# EAGLE design Piano Captouch (EAGLE 9.6.2)
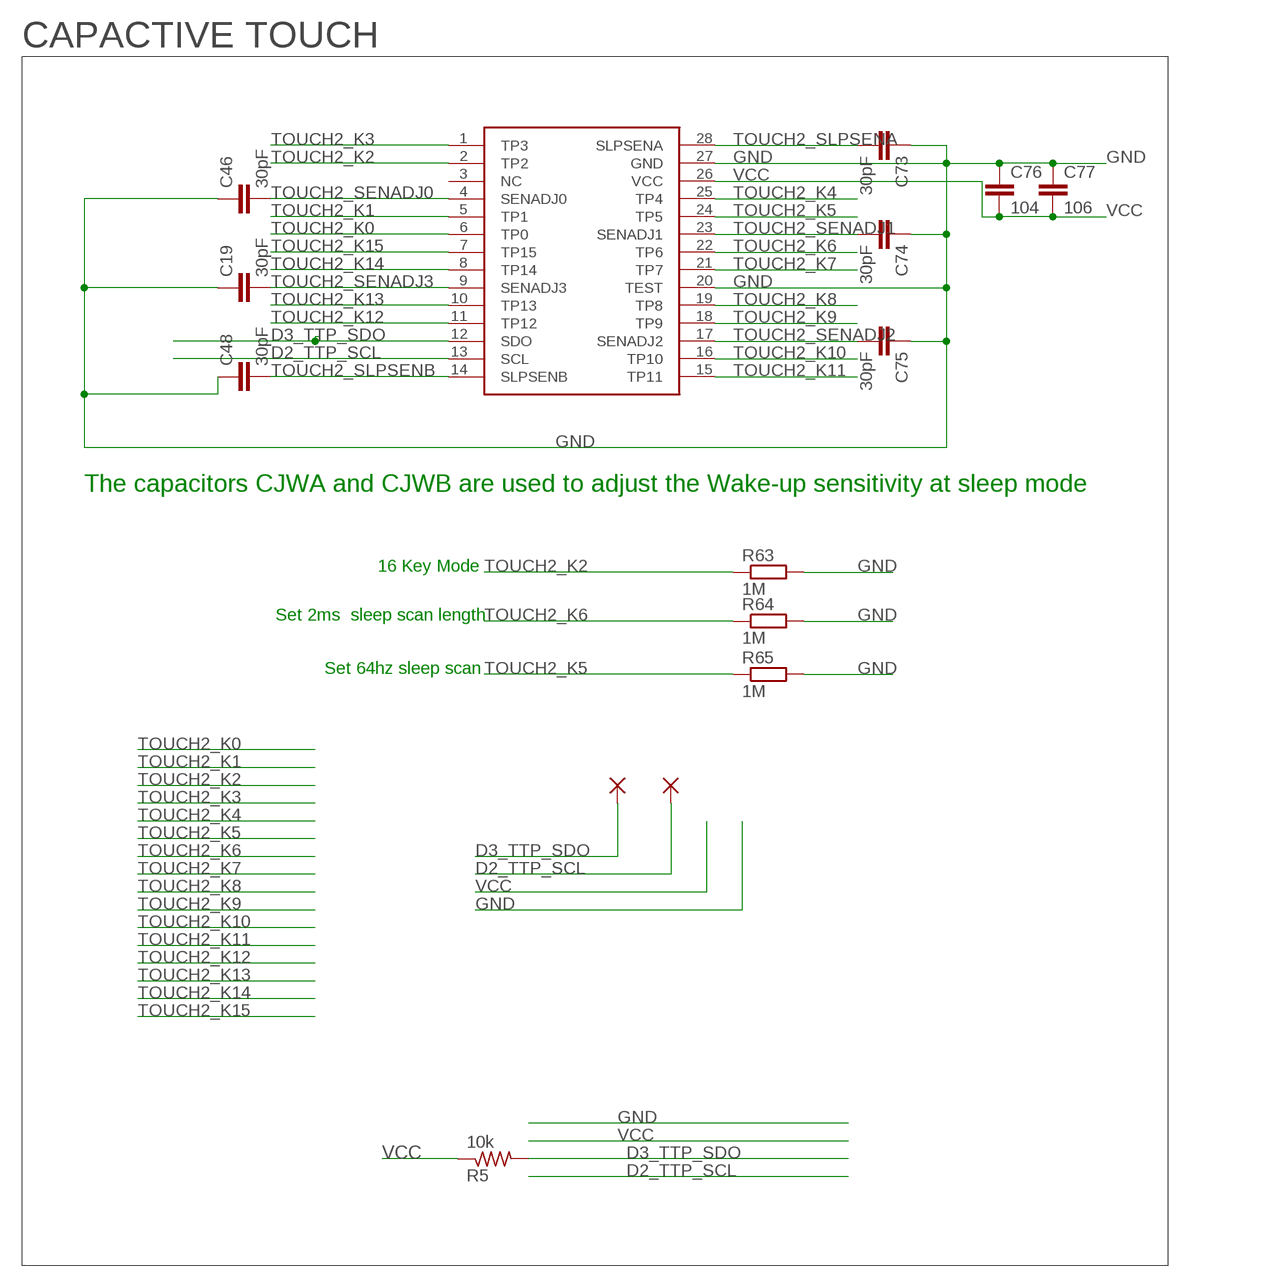
[diagram p0: schematic, sheet 1, part 1 of 2]
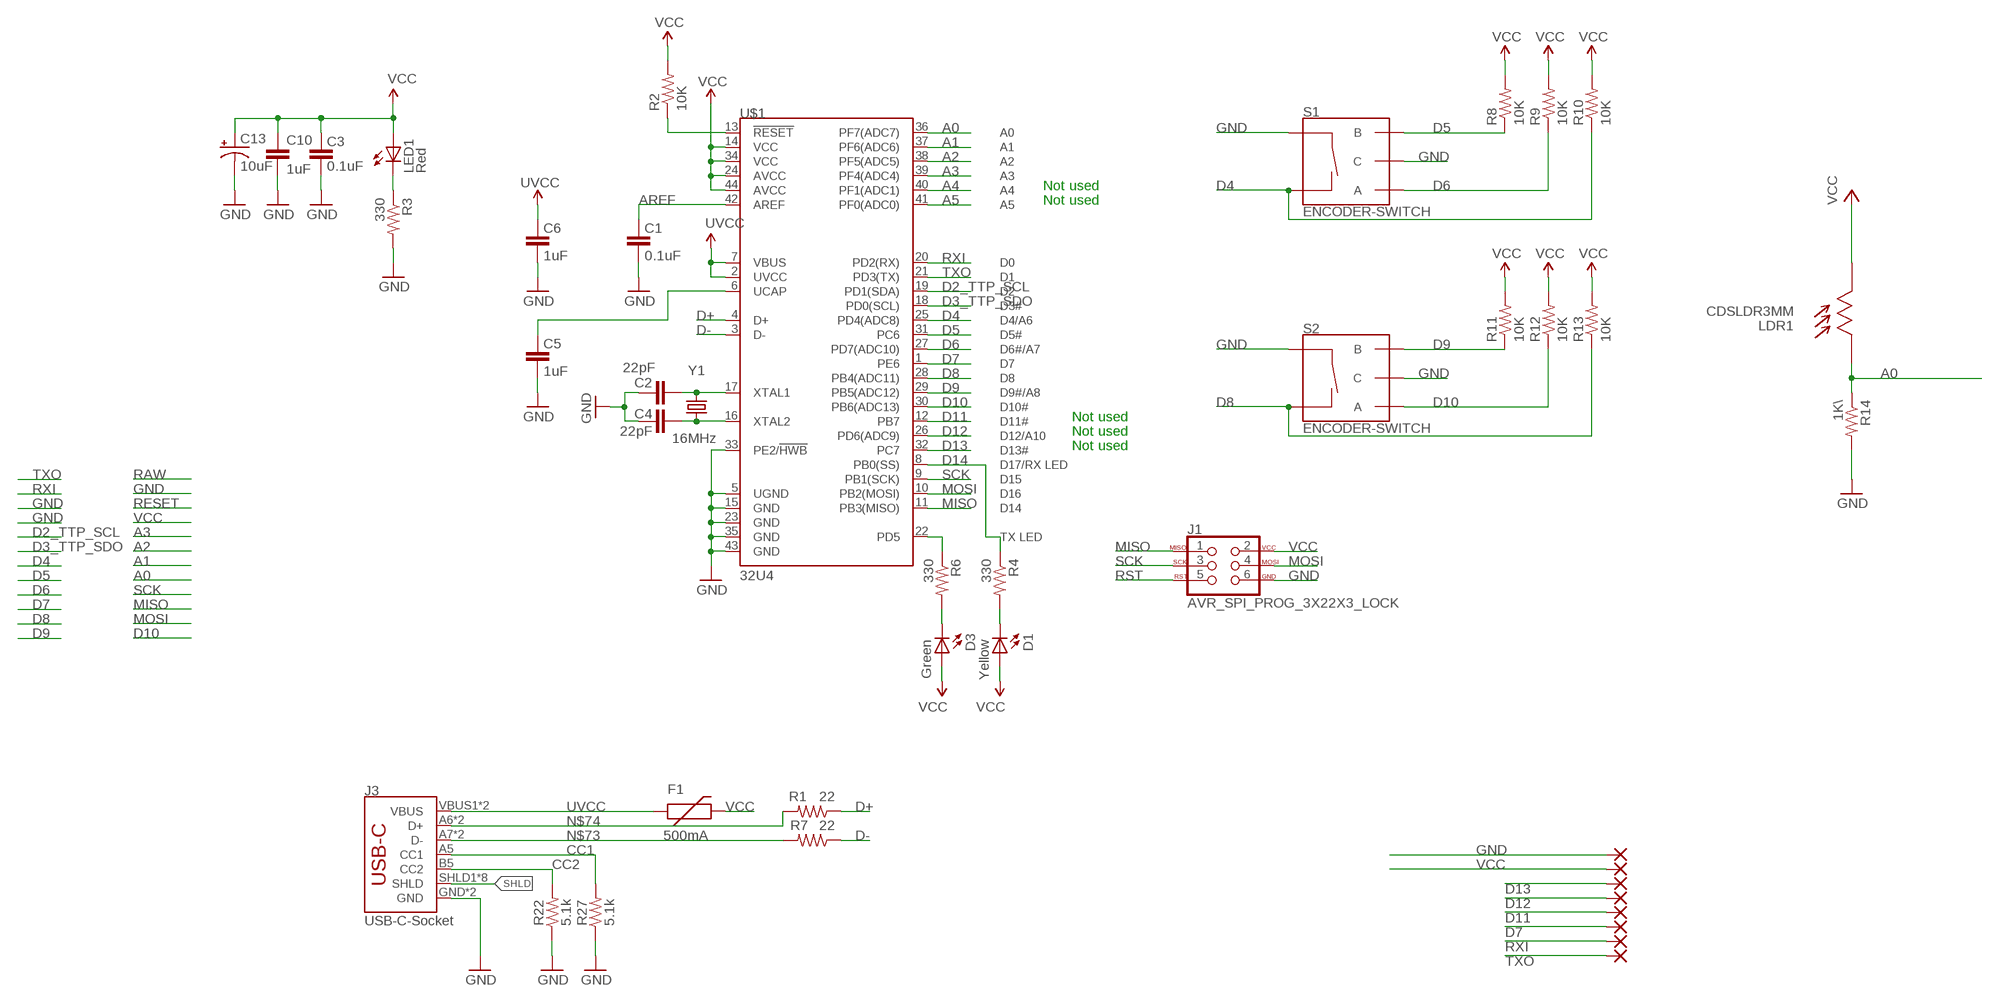
[diagram p1: schematic, sheet 1, part 2 of 2]

## Parts
C1  0.1uF  CAP0603-CAP  [0603-CAP]
C2  22pF  CAP0603-CAP  [0603-CAP]
C3  0.1uF  CAP0603-CAP  [0603-CAP]
C4  22pF  CAP0603-CAP  [0603-CAP]
C5  1uF  CAP0805  [0805]
C6  1uF  CAP0603-CAP  [0603-CAP]
C10  1uF  CAP0805  [0805]
C13  10uF  CAP_POL1206  [EIA3216]
C19  30pF  C-EUC0603K  [C0603K]
C46  30pF  C-EUC0603K  [C0603K]
C48  30pF  C-EUC0603K  [C0603K]
C73  30pF  C-EUC0603K  [C0603K]
C74  30pF  C-EUC0603K  [C0603K]
C75  30pF  C-EUC0603K  [C0603K]
C76  104  C-EUC0603K  [C0603K]
C77  106  C-EUC1206  [C1206]
D1  Yellow  LED0603  [LED-0603]
D3  Green  LED0603  [LED-0603]
F1  500mA  PTCSMD  [PTC-1206]
IC1  TTP229  [TTP229-SSOP28]
J1  AVR_SPI_PROG_3X22X3_LOCK  [2X3_LOCK]
J3  USB-C-Socket  USB_C16PIN  [USB-C-16P]
LDR1  CDSLDR3MM  [LDR3MM]
LED1  Red  LED0603  [LED-0603]
PAD1  2,15/1,0  [2,15/1,0]
PAD2  2,15/1,0  [2,15/1,0]
PAD3  2,15/1,0  [2,15/1,0]
PAD4  2,15/1,0  [2,15/1,0]
PAD5  2,15/1,0  [2,15/1,0]
PAD6  2,15/1,0  [2,15/1,0]
PAD7  2,15/1,0  [2,15/1,0]
PAD8  2,15/1,0  [2,15/1,0]
PAD9  2,15/1,0  [2,15/1,0]
PAD10  2,15/1,0  [2,15/1,0]
R1  22  RESISTOR0603-RES  [0603-RES]
R2  10K  RESISTOR0603-RES  [0603-RES]
R3  330  RESISTOR0603-RES  [0603-RES]
R4  330  RESISTOR0603-RES  [0603-RES]
R5  10k  R-US_R0603  [R0603]
R6  330  RESISTOR0603-RES  [0603-RES]
R7  22  RESISTOR0603-RES  [0603-RES]
R8  10K  RESISTOR0603-RES  [0603-RES]
R9  10K  RESISTOR0603-RES  [0603-RES]
R10  10K  RESISTOR0603-RES  [0603-RES]
R11  10K  RESISTOR0603-RES  [0603-RES]
R12  10K  RESISTOR0603-RES  [0603-RES]
R13  10K  RESISTOR0603-RES  [0603-RES]
R14  1K\  RESISTOR0603-RES  [0603-RES]
R22  5.1k  5.1KOHM5.1KOHM-0603-1/10W-1%  [0603@1]
R27  5.1k  5.1KOHM5.1KOHM-0603-1/10W-1%  [0603@1]
R63  1M  R-EU_R0603  [R0603]
R64  1M  R-EU_R0603  [R0603]
R65  1M  R-EU_R0603  [R0603]
S1  ENCODER-SWITCH  [ROTARY_ENC_PLAIN]
S2  ENCODER-SWITCH  [ROTARY_ENC_PLAIN]
U$1  32U4  ATMEGA32U4TQFP-44  [TQFP44]
Y1  16MHz  CRYSTALHC49UV  [HC49U-V]

## Nets
A0: LDR1.P$1 R14.1 U$1.36(PF7(ADC7))
A1: U$1.37(PF6(ADC6))
A2: U$1.38(PF5(ADC5))
A3: U$1.39(PF4(ADC4))
A4: U$1.40(PF1(ADC1))
A5: U$1.41(PF0(ADC0))
AREF: C1.2 U$1.42(AREF)
CC1: J3.A5(CC1) R27.2
CC2: J3.B5(CC2) R22.2
D2_TTP_SCL: IC1.13(SCL) PAD10.1(P) U$1.19(PD1(SDA))
D3_TTP_SDO: IC1.12(SDO) PAD9.1(P) R5.2 U$1.18(PD0(SCL))
D4: R10.1 S1.SW- U$1.25(PD4(ADC8))
D5: R8.1 S1.B U$1.31(PC6)
D6: R9.1 S1.A U$1.27(PD7(ADC10))
D7: PAD4.1(P) U$1.1(PE6)
D8: R13.1 S2.SW- U$1.28(PB4(ADC11))
D9: R11.1 S2.B U$1.29(PB5(ADC12))
D10: R12.1 S2.A U$1.30(PB6(ADC13))
D11: PAD3.1(P) U$1.12(PB7)
D12: PAD2.1(P) U$1.26(PD6(ADC9))
D13: PAD1.1(P) U$1.32(PC7)
D14: R4.1 U$1.8(PB0(SS))
D+: R1.1 U$1.4(D+)
D-: R7.1 U$1.3(D-)
GND: C1.1 C2.2 C3.1 C4.2 C5.1 C6.1 C10.2 C13.C(-) C19.1 C46.1 C48.1 C73.1 C74.1 C75.1 C76.1 C77.1 IC1.20(TEST) IC1.27(GND) J1.6 J3.GND J3.GND2(GND) PAD8.1(P) R3.2 R14.2 R22.1 R27.1 R63.2 R64.2 R65.2 S1.C S1.SW+ S2.C S2.SW+ U$1.5(UGND) U$1.15(GND) U$1.23(GND) U$1.33(PE2/!HWB) U$1.35(GND) U$1.43(GND)
MISO: J1.1 U$1.11(PB3(MISO))
MOSI: J1.4 U$1.10(PB2(MOSI))
N$6: LED1.C R3.1
N$33: C4.1 U$1.16(XTAL2) Y1.1
N$57: C2.1 U$1.17(XTAL1) Y1.2
N$71: C5.2 U$1.6(UCAP)
N$73: J3.A7(D-) J3.B7(D-) R7.2
N$74: J3.A6(D+) J3.B6(D+) R1.2
N$75: D1.C R4.2
N$76: D3.C R6.2
RESET: R2.1 U$1.13(!RESET)
RST: J1.5
RXI: PAD5.1(P) U$1.20(PD2(RX))
SCK: J1.3 U$1.9(PB1(SCK))
SHLD: J3.SHLD1(SHLD) J3.SHLD2(SHLD) J3.SHLD3(SHLD) J3.SHLD4(SHLD) J3.SHLD5(SHLD) J3.SHLD6(SHLD) J3.SHLD7(SHLD) J3.SHLD8(SHLD)
TOUCH2_K0: IC1.6(TP0)
TOUCH2_K1: IC1.5(TP1)
TOUCH2_K2: IC1.2(TP2) R63.1
TOUCH2_K3: IC1.1(TP3)
TOUCH2_K4: IC1.25(TP4)
TOUCH2_K5: IC1.24(TP5) R65.1
TOUCH2_K6: IC1.22(TP6) R64.1
TOUCH2_K7: IC1.21(TP7)
TOUCH2_K8: IC1.19(TP8)
TOUCH2_K9: IC1.18(TP9)
TOUCH2_K10: IC1.16(TP10)
TOUCH2_K11: IC1.15(TP11)
TOUCH2_K12: IC1.11(TP12)
TOUCH2_K13: IC1.10(TP13)
TOUCH2_K14: IC1.8(TP14)
TOUCH2_K15: IC1.7(TP15)
TOUCH2_SENADJ0: C46.2 IC1.4(SENADJ0)
TOUCH2_SENADJ1: C74.2 IC1.23(SENADJ1)
TOUCH2_SENADJ2: C75.2 IC1.17(SENADJ2)
TOUCH2_SENADJ3: C19.2 IC1.9(SENADJ3)
TOUCH2_SLPSENA: C73.2 IC1.28(SLPSENA)
TOUCH2_SLPSENB: C48.2 IC1.14(SLPSENB)
TXLED: R6.1 U$1.22(PD5)
TXO: PAD6.1(P) U$1.21(PD3(TX))
UVCC: C6.2 F1.1 J3.VBUS1(VBUS) J3.VBUS2(VBUS) U$1.2(UVCC) U$1.7(VBUS)
VCC: C3.2 C10.1 C13.A(+) C76.2 C77.2 D1.A D3.A F1.2 IC1.26(VCC) J1.2 LDR1.P$2 LED1.A PAD7.1(P) R2.2 R5.1 R8.2 R9.2 R10.2 R11.2 R12.2 R13.2 U$1.14(VCC) U$1.24(AVCC) U$1.34(VCC) U$1.44(AVCC)
Unconnected: IC1.3(NC)

## Notes on the sheet
- CAPACTIVE TOUCH
- Not used
- Not used
- The capacitors CJWA and CJWB are used to adjust the Wake-up sensitivity at sleep mode
- 16 Key Mode
- Set 2ms  sleep scan length | Not used
- Not used
- Not used
- Set 64hz sleep scan

## Library data of the parts
C1-C6 C10 = SparkFun:CAP: Capacitor Standard 0603 ceramic capacitor, and 0.1" leaded capacitor.
C13 = SparkFun:CAP_POL: Capacitor Polarized These are standard SMD and PTH capacitors. Normally 10uF, 47uF, and 100uF in electrolytic and tantalum varieties. Always verify the external diameter of the through hole cap, it varies with capacity, voltage, and manufacturer. The EIA devices should be standard.
C19 C46 C48 C73-C77 = rcl:C-EU: CAPACITOR, European symbol; SPICEPREFIX: C
D1 D3 LED1 = SparkFun:LED: LEDs Standard schematic elements and footprints for 5mm, 3mm, 1206, and 0603 sized LEDs. 5mm - Spark Fun Electronics SKU : COM-00529 (and others)
F1 = SparkFun:PTC: Resettable Fuse PTC Resettable Fuse. Spark Fun Electronics SKU : COM-08357
IC1 = ttp229:TTP229
J1 = SparkFun-Connectors:AVR_SPI_PROG_3X2: AVR ISP 6 Pin This is the reduced ISP connector for AVR programming. Common on Arduino. This footprint will take up less PCB space and can be used with a 10-pin to 6-pin adapter such as SKU: BOB-08508 **Special note about "TEST_POINT" package. The stop mask is on the top side, so if you want your programming test points to be on the bottom of your board, make sure to place this package on the bottom side of the board. This also ensure that the orientation to program from the bottom side will be correct. SparkFun Products: SparkFun ISP Pogo Adapter <https://www.sparkfun.com/products/11591> - NS Tiny AVR Programmer <https://www.sparkfun.com/products/11801> -PTH
J3 = SparkFun-Connectors:USB_C: USB Type C 16Pin Connector Super Speed pins not available on the 16-pin purely SMD connector so this part is best for USB 2.0 implementations. D1 and D2 are tied together enabling D+/- no matter which way the cable is plugged into the connector. The two channel configuration pins (CC1/2) are exposed. These are normally connected to ground via 5.1k resistors but can be reconfigured for high current/high power applications.; PROD_ID: CONN-14122
LDR1 = CEDTv40:CDSLDR3MM
PAD1-PAD10 = wirepad:2,15/1,0: THROUGH-HOLE PAD
R1-R4 R6-R14 = SparkFun:RESISTOR: Resistor Basic schematic elements and footprints for 0603, 1206, and PTH resistors.
R5 = adafruit:R-US_: RESISTOR, American symbol
R22 R27 = SparkFun-Resistors:5.1KOHM; PROD_ID: RES-12083
R63-R65 = rcl:R-EU_: RESISTOR, European symbol; SPICEPREFIX: R
S1 S2 = SparkFun-Switches:ENCODER-SWITCH: Rotary Encoder w/ Select Switch Encoders rotate similarly to potentiometers, but they’re different from potentiometers in that an encoder has full rotation without limits. They output gray code so that you can tell how much and in which direction the encoder has been turned. This encoder includes a push-down select switch built into the shaft. SparkFun Products Rotary Encoder <https://www.sparkfun.com/products/9117> (COM-09117); SF_SKU: COM-09117
U$1 = SparkFun-IC-Microcontroller:ATMEGA32U4: Atmel MCU, 32KByte Atmel 44-pin 8-bit Microcontroller with 32KBytes of ISP Flash and USB Controller Datasheet <http://cdn.sparkfun.com/datasheets/Dev/Arduino/Boards/ATMega32U4.pdf> SparkFun Products LilyPad Arduino USB - ATmega32U4 Board <https://www.sparkfun.com/products/12049> (DEV-12049) Pro Micro - 5V/16MHz <https://www.sparkfun.com/products/12640> (DEV-12640) Pro Micro - 3.3V/8MHz <https://www.sparkfun.com/products/12587> (DEV-12587) Fio v3 - ATmega32U4 <https://www.sparkfun.com/products/11520> (DEV-11520) Qduino Mini <https://www.sparkfun.com/products/13614> (DEV-13614) Makey Makey - Standard Kit <https://www.sparkfun.com/products/11511> (WIG-11511) Makey Makey Deluxe Kit <https://www.sparkfun.com/products/11519> (WIG-11519); PROD_ID: IC-11161
Y1 = SparkFun:CRYSTAL: Crystals Various standard crystals. Proven footprints. Spark Fun Electronics SKU : COM-00534

## Net classes
0 default: width 0.152 mm, drill 0.305 mm, clearance 0.152 mm
1 vcc: width 0.152 mm, drill 0.305 mm, clearance 0.152 mm

## Board
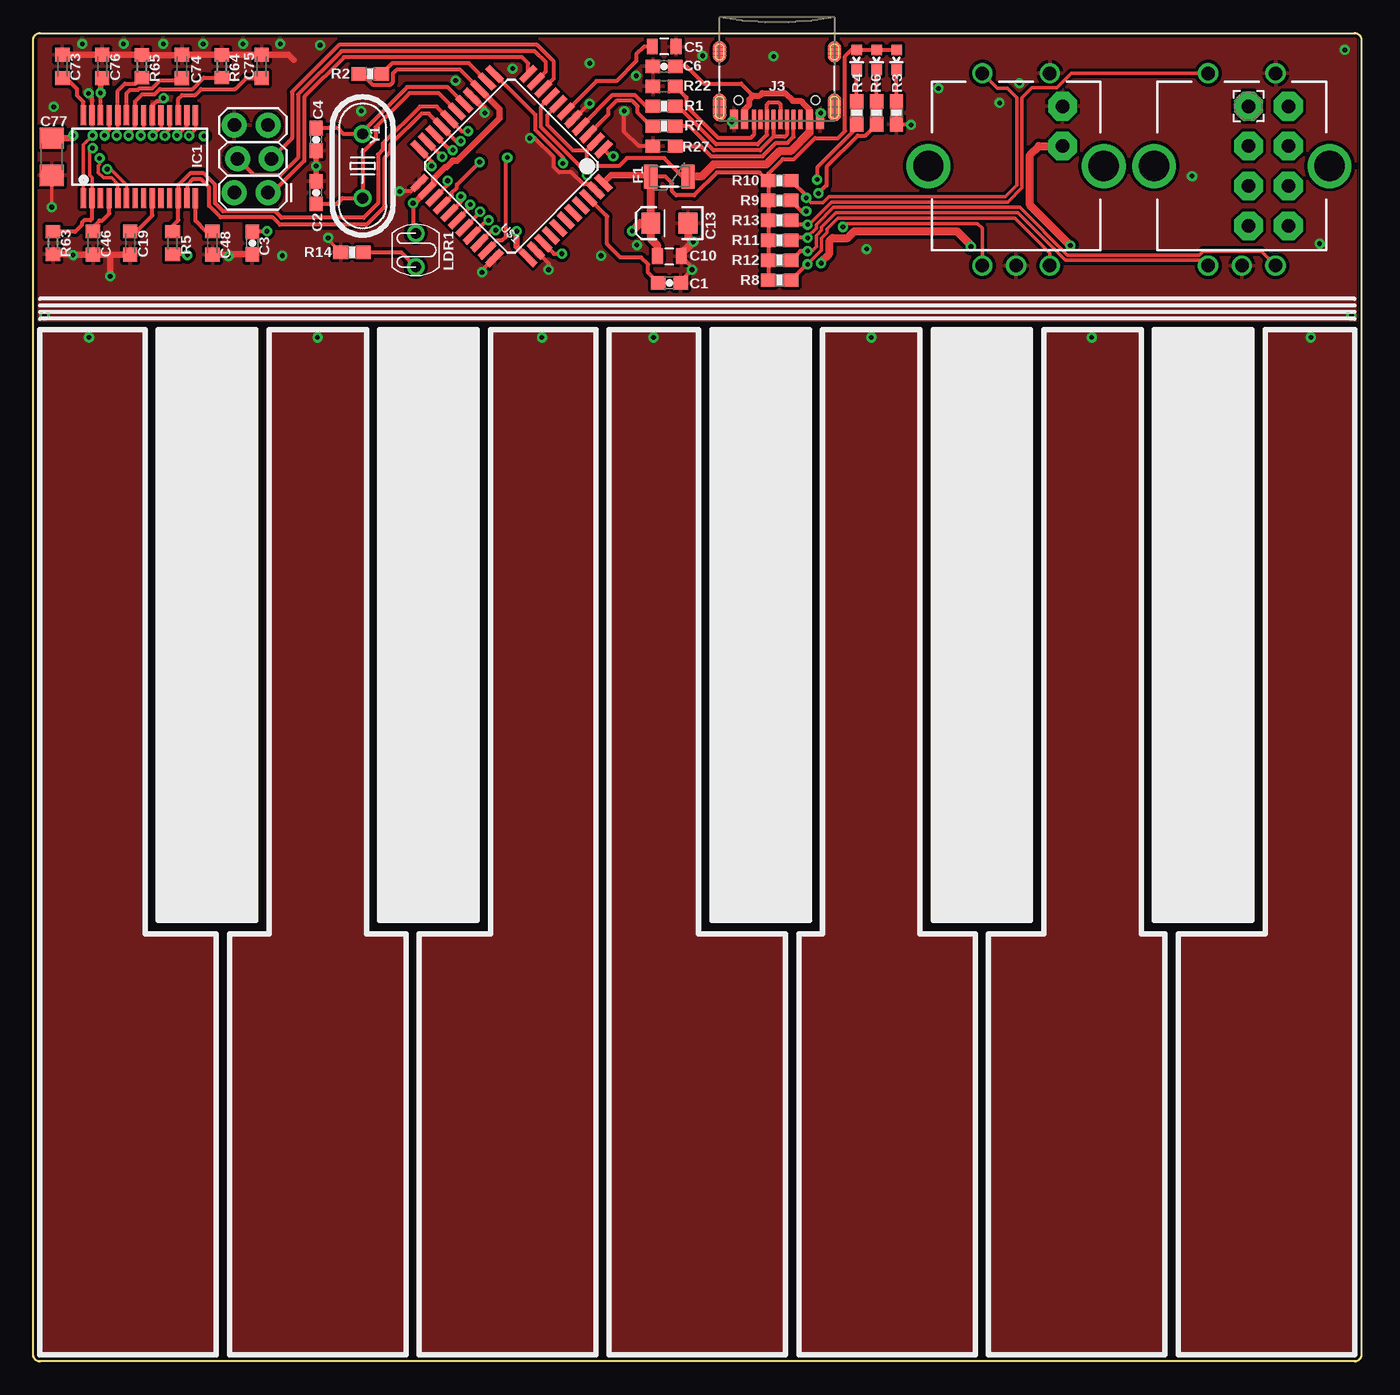
[diagram p2: board, top side]
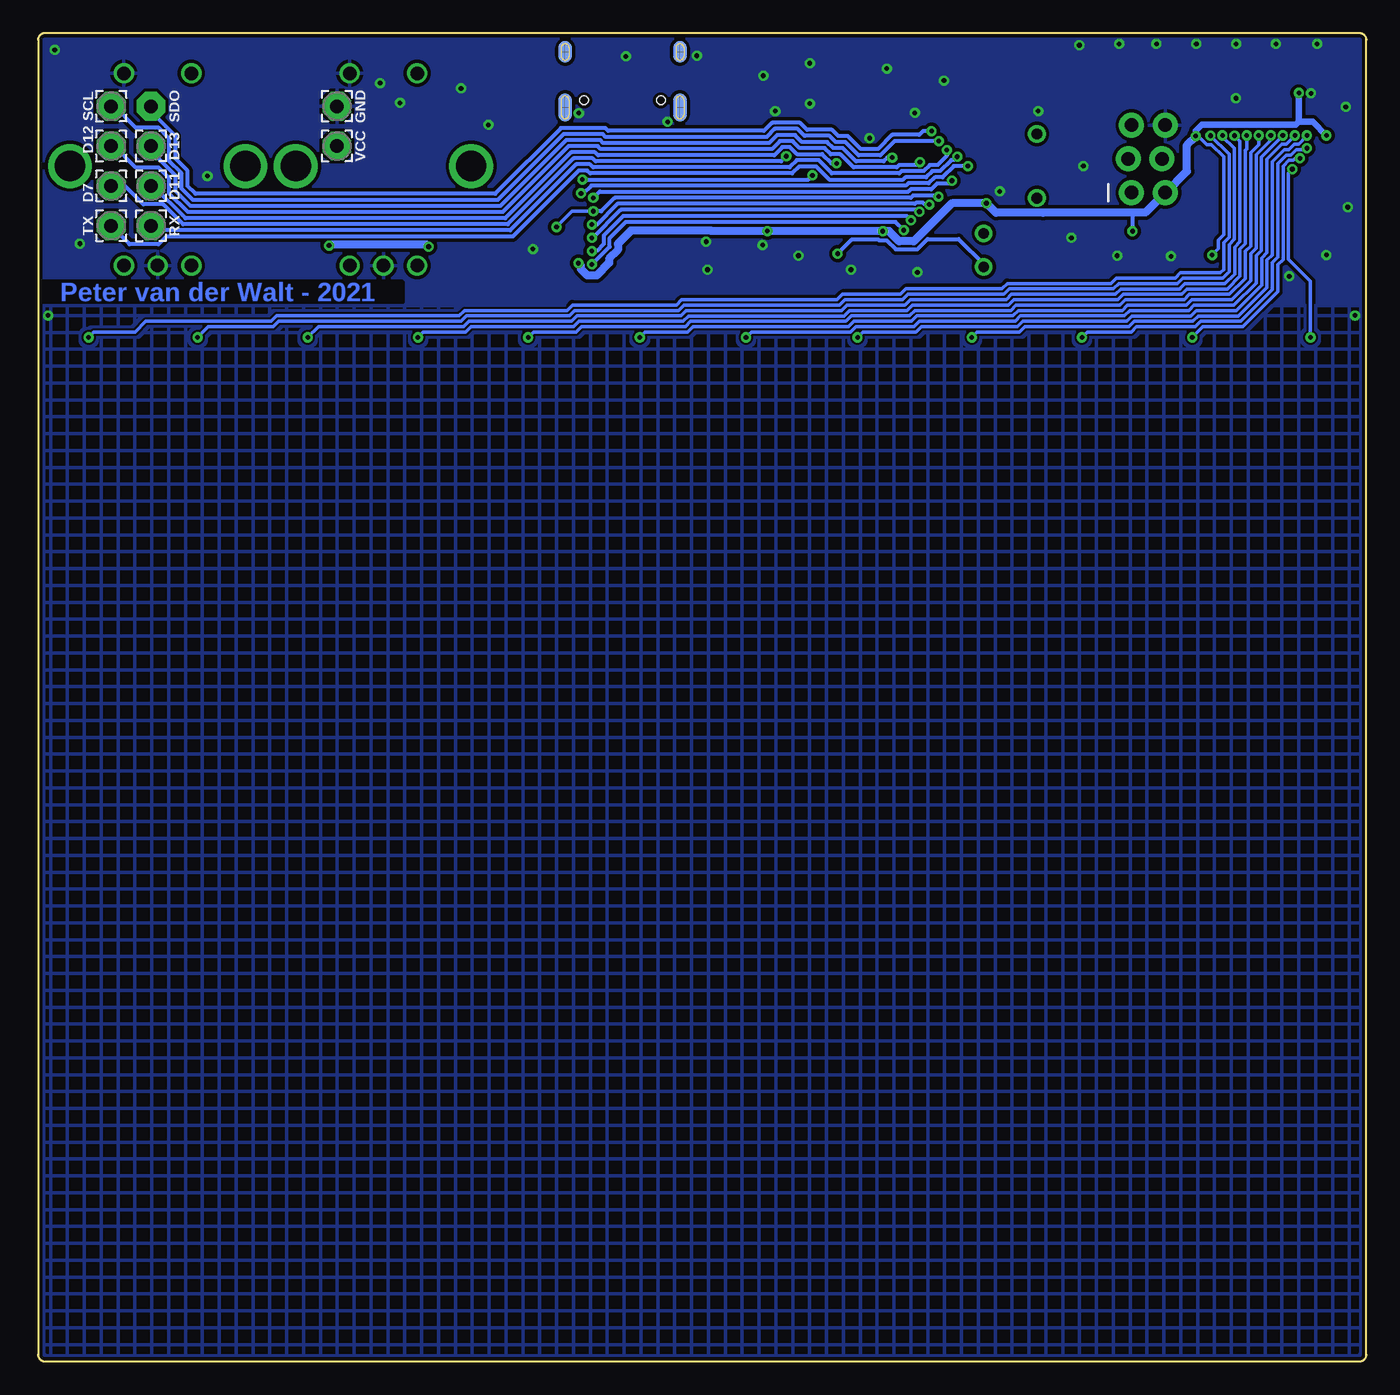
[diagram p3: board, bottom side, seen from below]

Size 100 x 100 mm. Coordinates in mm from the lower left corner, seen from the top.
Outline: 100,99.5 100,0.5 arc-90 99.5,0 0.5,0 arc-90 0,0.5 0,99.5 arc-90 0.5,100 99.5,100 arc-90 100,99.5
Copper layers (1*16): Top 0.035mm / dielectric 1.5mm / Bottom 0.035mm
Design rules "default *": minimum track width 6mil, minimum drill 0.35mm, track to track 6mil, track to pad 6mil, pad to pad 6mil, via to via 6mil, smd to smd 6mil, copper to edge 10mil, drill to drill 6mil, minimum pad ring 10mil, minimum via ring 8mil, stop-mask expansion 4mil, vias tented up to drill 0mil, thermal gap 10mil

### Footprints (pad centres in the part's own frame; a part is rotated, then mirrored left to right if it is on the bottom)
0603-CAP = smd 1.1 x 1: 1 -0.85,0; 2 0.85,0
0805 = smd 0.8 x 1.2: 1 -0.9,0; 2 0.9,0
EIA3216 = smd 1.4 x 1.6: A 1.4,0; C -1.4,0
C0603K = smd 1.05 x 1.08: 1 -0.875,0; 2 0.875,0
C1206 = smd 1.6 x 1.8: 1 -1.4,0; 2 1.4,0
LED-0603 = smd 0.8 x 0.8: A 0,-0.75; C 0,0.75
PTC-1206 = smd 1 x 1.8: 1 -1.4,0; 2 1.4,0
TTP229-SSOP28 = smd 0.4 x 1.5: 1 -4.225,-3.125; 2 -3.575,-3.125; 3 -2.925,-3.125; 4 -2.275,-3.125; 5 -1.625,-3.125; 6 -0.975,-3.125; 7 -0.325,-3.125; 8 0.325,-3.125; 9 0.975,-3.125; 10 1.625,-3.125; 11 2.275,-3.125; 12 2.925,-3.125; 13 3.575,-3.125; 14 4.225,-3.125; 15 4.225,3.125; 16 3.575,3.125; 17 2.925,3.125; 18 2.275,3.125; 19 1.625,3.125; 20 0.975,3.125; 21 0.325,3.125; 22 -0.325,3.125; 23 -0.975,3.125; 24 -1.625,3.125; 25 -2.275,3.125; 26 -2.925,3.125; 27 -3.575,3.125; 28 -4.225,3.125
2X3_LOCK = drill 1.016 pad 1.88: 1 0,0.127; 2 0,2.667; 3 2.54,-0.127; 4 2.54,2.413; 5 5.08,0.127; 6 5.08,2.667
USB-C-16P = smd 0.3 x 1.45: A5 -1.25,0; A6 -0.25,0; A7 0.25,0; A8 1.25,0; B5 1.75,0; B6 0.75,0; B7 -0.75,0; B8 -1.75,0 | smd 0.6 x 1.45: GND -3.225,0; GND2 3.225,0 | smd 1 x 2.1: SHLD1 -4.32,-0.915; SHLD2 4.32,-0.915 | smd 1 x 2.1 bottom: SHLD3 -4.32,-0.915; SHLD4 4.32,-0.915 | smd 1 x 1.6: SHLD5 -4.32,-5.095; SHLD8 4.32,-5.095 | smd 1 x 1.6 bottom: SHLD6 -4.32,-5.095; SHLD7 4.32,-5.095 | smd 0.55 x 1.45: VBUS1 -2.45,0; VBUS2 2.45,0 | hole 0.65: -2.89,-1.445; 2.89,-1.445
LDR3MM = drill 0.8: P$1 0,0; P$2 2.54,0
2,15/1,0 = drill 1.016 pad 2.159 octagon: 1 0,0
0603-RES = smd 1.1 x 1: 1 -0.85,0; 2 0.85,0
R0603 = smd 1 x 1.1: 1 -0.85,0; 2 0.85,0
0603@1 = smd 1.1 x 1: 1 -0.85,0; 2 0.85,0
ROTARY_ENC_PLAIN = drill 1.016: A 7.493,-2.54; B 7.493,2.54; C 7.493,0; SW+ -6.985,2.54; SW- -6.985,-2.54 | drill 2.286: P$3 0,6.604; P$4 0,-6.604
TQFP44 = smd 1.5 x 0.5: 1 -5.8,4; 2 -5.8,3.2; 3 -5.8,2.4; 4 -5.8,1.6; 5 -5.8,0.8; 6 -5.8,0; 7 -5.8,-0.8; 8 -5.8,-1.6; 9 -5.8,-2.4; 10 -5.8,-3.2; 11 -5.8,-4; 23 5.8,-4; 24 5.8,-3.2; 25 5.8,-2.4; 26 5.8,-1.6; 27 5.8,-0.8; 28 5.8,0; 29 5.8,0.8; 30 5.8,1.6; 31 5.8,2.4; 32 5.8,3.2; 33 5.8,4 | smd 0.5 x 1.5: 12 -4,-5.8; 13 -3.2,-5.8; 14 -2.4,-5.8; 15 -1.6,-5.8; 16 -0.8,-5.8; 17 0,-5.8; 18 0.8,-5.8; 19 1.6,-5.8; 20 2.4,-5.8; 21 3.2,-5.8; 22 4,-5.8; 34 4,5.8; 35 3.2,5.8; 36 2.4,5.8; 37 1.6,5.8; 38 0.8,5.8; 39 0,5.8; 40 -0.8,5.8; 41 -1.6,5.8; 42 -2.4,5.8; 43 -3.2,5.8; 44 -4,5.8
HC49U-V = drill 0.813: 1 -2.413,0; 2 2.413,0

### Placement (x,y rotation side)
C1  47.9,81.2 180 top
C2  21.3,88 90 top
C3  16.5,84.2 90 top
C4  21.3,92 270 top
C5  47.5,99 180 top
C6  47.5,97.5 0 top
C10  47.9,83.2 0 top
C13  47.9,85.7 180 top
C19  7.3,84.2 90 top
C46  4.5,84.2 90 top
C48  13.5,84.2 90 top
C73  2.2,97.5 270 top
C74  11.2,97.5 270 top
C75  17.2,97.5 270 top
C76  5.2,97.5 270 top
C77  1.4,90.7 90 top
D1  62,98 180 top
D3  63.5,98 180 top
F1  47.9,89.2 180 top
IC1  8,90.7 0 top
J1  17.8,88 90 top
J3  56,93.5 180 top
LDR1  28.8,82.4 90 top
LED1  65,98 180 top
PAD1  91.5,91.5 0 bottom
PAD2  94.5,91.5 0 bottom
PAD3  91.5,88.5 0 bottom
PAD4  94.5,88.5 0 bottom
PAD5  91.5,85.5 0 bottom
PAD6  94.5,85.5 0 bottom
PAD7  77.5,91.5 0 bottom
PAD8  77.5,94.5 0 bottom
PAD9  91.5,94.5 0 top
PAD10  94.5,94.5 0 bottom
R1  47.5,94.5 0 top
R2  25.38,96.94 180 top
R3  65,94 270 top
R4  62,94 90 top
R5  10.5,84.2 90 top
R6  63.5,94 90 top
R7  47.5,93 0 top
R8  56.2,81.4 180 top
R9  56.2,87.4 180 top
R10  56.2,88.9 180 top
R11  56.2,84.4 180 top
R12  56.2,82.9 180 top
R13  56.2,85.9 180 top
R14  24,83.5 180 top
R22  47.5,96 0 top
R27  47.5,91.5 0 top
R63  1.5,84.2 270 top
R64  14.2,97.5 90 top
R65  8.2,97.5 90 top
S1  74,90 270 top
S2  91,90 270 top
U$1  36,90 225 top
Y1  24.8,90 270 top

### Tracks (layer width: path | path; a pad name or v marks a point on that pad's centre or on a via)
A0  (via drill 0.35)
  Top 0.305: U$1.36 39.21,83.4 v39.8,83.4 | R14.1 27.7,83.5 LDR1.P$1
  Bottom 0.305: v39.8,83.4 38.71,84.49 36.76,84.49 36.68,84.42 36.12,84.42 35.43,83.73 33.81,83.73 33.04,84.5 30.7,84.5 28.8,82.6 LDR1.P$1
AREF
  Top 0.305: C1.2 46.3,81.95 46.3,82.61 45.78,83.12 44.22,83.12 43.22,84.12 43.22,86.2 43.12,86.3 43.09,86.3 U$1.42
CC1
  Top 0.305: R27.2 50.26,91.5 51.03,90.73 54.92,90.73 55.94,91.74 56.79,91.74 57.25,92.2 J3.A5
CC2
  Top 0.305: J3.B5 54.25,92.35 54,92.1 51.6,92.1 49.2,94.5 49.2,95.14 R22.2
D2_TTP_SCL  (via drill 0.35)
  Top 0.305: IC1.13 11.57,88.58 12,89 12.65,89 13.24,88.41 13.24,87.01 14.11,86.14 18.01,86.14 18.58,85.58 25.1,85.58 26.42,86.9 26.42,90.58 26.88,91.03 26.88,91.59 29.24,93.96 29.78,93.96 U$1.19 31.85,91.89 v32.19,91.89
  Bottom 0.305: v32.19,91.89 35.52,91.89 36.59,90.81 38.23,90.81 39.22,91.8 39.94,91.8 40.4,92.27 42.3,92.27 42.82,92.8 44.55,92.8 45.16,92.19 57.26,92.19 57.48,92.41 60.44,92.41 65.4,87.44 88.33,87.44 89.2,88.31 89.2,89.45 90.12,90.37 90.12,92.07 90.93,92.88 92.63,92.88 94.25,94.5 PAD10.1
D3_TTP_SDO  (via drill 0.35)
  Top 0.305: R5.2 10.5,85.5 10.93,85.92 IC1.12 10.93,88.57 11.81,89.46 12.84,89.46 13.7,88.6 13.7,87.2 14.3,86.6 18.2,86.6 18.7,86.1 24.88,86.1 25.96,87.19 25.96,90.87 26.32,91.22 26.32,91.68 29.12,94.48 30.39,94.48 U$1.18 32.24,92.63 v32.73,92.63
  Bottom 0.305: v32.73,92.63 33.37,92.63 33.66,92.34 35.7,92.34 36.77,91.27 38.04,91.27 39.03,92.26 39.75,92.26 40.22,92.73 42.11,92.73 42.63,93.25 44.74,93.25 45.35,92.64 57.07,92.64 57.29,92.87 60.63,92.87 65.59,87.9 88.14,87.9 88.74,88.5 88.74,89.64 89.66,90.56 89.66,92.26 91.5,94.1 PAD9.1
D4  (via drill 0.35)
  Top 0.254: v58.2,87.6 58.56,87.24 59.46,87.24 59.92,87.7 73.2,87.7 74.05,88.55 74.05,95.14 73.34,95.85 72.6,95.85 S1.SW-
  Top 0.305: v58.2,87.6 58.2,87.75 R10.1 | U$1.25 31.2,88.59 v31.2,88.9
  Bottom 0.305: v31.2,88.9 31.4,88.7 32.3,88.7 32.76,88.24 34.31,88.24 34.48,88.07 57.73,88.07 v58.2,87.6
D5  (via drill 0.35)
  Top 0.254: S1.B 76.54,83.43 73.9,86.07 60.6,86.07 59.77,85.25 59.77,84.99 59.36,84.58 59.36,83.66 v58.3,82.6
  Top 0.305: v58.3,82.6 58.25,82.6 R8.1 | U$1.31 34.57,85.17 v34.83,85.17
  Bottom 0.305: v34.83,85.17 35.44,85.79 55.76,85.79 56.96,84.58 56.96,83.93 58.29,82.6 v58.3,82.6
D6  (via drill 0.35)
  Top 0.254: S1.A 71.46,85.31 71.1,85.67 61.27,85.67 61.02,85.42 v60.97,85.42
  Top 0.305: R9.1 57.85,86.6 v58.2,86.6 | U$1.27 32.2,87.33 v32.2,87.7
  Bottom 0.254: v60.97,85.42 59.79,86.6 v58.2,86.6
  Bottom 0.305: v32.2,87.7 32.53,87.7 32.62,87.78 34.12,87.78 34.29,87.61 56.59,87.61 57.6,86.6 v58.2,86.6
D7  (via drill 0.35)
  Top 0.305: U$1.1 43.46,90.74 v43.67,90.74
  Bottom 0.305: v43.67,90.74 44.06,90.36 58.02,90.36 58.24,90.58 59.68,90.58 64.65,85.61 89.09,85.61 90.59,87.12 92.07,87.12 93.46,88.5 PAD4.1
D8  (via drill 0.35)
  Top 0.254: S2.SW- 78.16,96.98 77.08,95.9 75.2,95.9 74.46,95.16 74.46,88.38 73.37,87.29 60.09,87.29 58.4,85.6 v58.3,85.6
  Top 0.305: v58.3,85.6 57.35,85.6 R13.1 | U$1.28 32.9,86.9 v32.9,87.1
  Bottom 0.305: v32.9,87.1 33.22,87.1 33.36,87.24 33.93,87.24 34.01,87.16 56.38,87.16 57.93,85.6 v58.3,85.6
D9  (via drill 0.35)
  Top 0.254: v58.3,84.6 58.3,84.67 58.96,85.33 58.96,85.58 60.26,86.89 74.29,86.89 77.87,83.31 87.79,83.31 88.08,83.6 92.45,83.6 S2.B
  Top 0.305: v58.3,84.6 57.25,84.6 R11.1 | U$1.29 33.64,86.51 v33.64,86.56
  Bottom 0.305: v33.64,86.56 33.78,86.7 56.13,86.7 58.23,84.6 v58.3,84.6
D10  (via drill 0.35)
  Top 0.254: v58.3,83.6 58.63,83.6 58.96,83.93 58.96,84.75 59.36,85.16 59.36,85.42 60.43,86.48 74.12,86.48 77.7,82.9 88.07,82.9 S2.A
  Top 0.305: v58.3,83.6 57.75,83.6 R12.1 | U$1.30 34.18,85.92 v34.28,85.92
  Bottom 0.305: v34.28,85.92 34.61,86.24 55.95,86.24 57.42,84.77 57.42,84.12 57.93,83.6 v58.3,83.6
D11  (via drill 0.35)
  Top 0.305: U$1.12 37.79,93.87 37.79,92.72 39.88,90.63 v39.88,90.21
  Bottom 0.305: v39.88,90.21 40.28,90.21 40.97,90.9 42.87,90.9 43.39,91.42 43.96,91.42 44.57,90.81 57.83,90.81 58.05,91.04 59.87,91.04 64.84,86.07 88.9,86.07 91.33,88.5 PAD3.1
D12  (via drill 0.35)
  Top 0.305: U$1.26 31.52,87.78 31.52,87.98 31.9,88.37 31.9,88.6 33.59,90.3 v33.61,90.3
  Bottom 0.305: v33.61,90.3 33.84,90.07 35.18,90.07 35.35,89.9 38.61,89.9 39.6,90.89 40.32,90.89 40.78,91.36 42.68,91.36 43.2,91.88 44.15,91.88 44.76,91.27 57.64,91.27 57.86,91.49 60.06,91.49 65.03,86.53 88.71,86.53 90.12,87.93 90.12,89.07 90.93,89.88 92.63,89.88 94.25,91.5 PAD2.1
D13  (via drill 0.35)
  Top 0.305: U$1.32 34.92,84.4 35.3,84.4 35.6,84.7 35.6,90.54 v35.7,90.64
  Bottom 0.305: v35.7,90.64 36.06,90.64 36.34,90.36 38.42,90.36 39.41,91.35 40.13,91.35 40.59,91.81 42.49,91.81 43.01,92.34 44.36,92.34 44.97,91.73 57.45,91.73 57.67,91.95 60.25,91.95 65.21,86.99 88.52,86.99 89.66,88.12 89.66,89.26 91.5,91.1 PAD1.1
D14  (via drill 0.35)
  Top 0.305: v41.7,89.3 41.7,89.45 38.24,92.91 38.24,94.51 U$1.8 | R4.1 62,92.85 59.02,89.87 v59.02,88.98
  Bottom 0.305: v41.7,89.3 42.01,88.99 v59.01,88.99 v59.02,88.98
D+
  Top 0.305: U$1.4 43.62,95.36 45.29,95.36 46.15,94.5 R1.1
D-
  Top 0.305: R7.1 46.5,93 45.5,94 45.5,94.5 45.1,94.9 43.9,94.9 43.3,94.3 43.3,93.9 U$1.3
GND  (via drill 0.35)
  Top 0.254: R14.2 22.2,84.45 v22.2,84.6 | v1.4,86.9 C77.1
  Top 0.305: 8.97,94.59 IC1.20 8.97,94.56 9.3,94.88 9.59,94.88 v9.82,95.11 | IC1.27 4.42,95.21 v4.17,95.47 | U$1.5 41.83,94.7 v41.9,94.7 | R3.2 66.05,93.15 v66.1,93.1 | C1.1 48.75,81.35 v49.6,82.2 49.6,82.4 C10.2 | J3.GND2 v52.6,93.33 | R27.1 45.6,91.5 44.5,92.6 v44.5,94.14 | J3.GND 59.23,93.93 v59.29,93.99 | U$1.35 38.8,82.67 v38.8,82.2 | U$1.33 33.8,82.14 v33.8,82 | U$1.43 41.91,88.62 41.42,88.62 40.51,89.52 39.6,89.52 39.2,89.92 39.2,90.66 37.76,92.1 v37.4,92.1 | U$1.23 28.44,88.1 v27.6,88.1
  Top 0.406: C4.2 v21.3,90 C2.2 | U$1.15 34,94.26 v34,94
  Top 0.508: R63.2 2.95,83.35 v3,83.3 3.02,83.33 C46.1 6,83.33 | C48.1 14.57,83.33 v14.7,83.2 14.85,83.35 C3.1 | C73.1 C76.1 8.18,98.38 R65.2 11.18,98.35 C74.1 14.18,98.38 R64.2 14.22,98.38 C75.1 19.23,98.38 19.6,98 | 6,83.33 C19.1 | v5.8,81.7 5.8,83.12 6,83.33
  Top 0.61: C10.2 48.8,83.4 v49.7,84.3 49.3,84.7 C13.C
  other vias: 45.4,96.8 41.9,97.74 99.25,78.75 0.85,78.75 98.75,98.75 1.55,94.45 18.75,83.25 96.85,84.15 42.75,83.25 55.75,98.25 62.75,83.75 87.25,89.25 72.75,94.75 74.25,96.25 68.15,95.85 24.7,94.14 31.8,96.44 36.1,97.34 45.45,84.05 50.4,98.3 3.7,99.2 6.8,99.2 9.8,99.2 12.8,99.2 15.8,99.2 18.6,99.2 21.6,99.1
  pour Bottom (rank 6, hatched): 0,79.5 100,79.5 100,0 0,0
  pour Top (isolate 0.254, rank 6): 0,100 100,100 100,78.4 0,78.4
  pour Bottom (isolate 0.254, rank 6): 0,100 100,100 100,79.5 0,79.5
MISO
  Top 0.305: U$1.11 37.27,97.73 36.8,98.2 23.4,98.2 20.4,95.2 20.4,90.4 18,88 J1.1
MOSI
  Top 0.305: U$1.10 38.6,97.12 38.6,97.8 37.74,98.66 23.21,98.66 19.94,95.39 19.94,90.64 18.59,89.3 16.63,89.3 J1.4
N$6
  Top 0.305: R3.1 LED1.C
N$33
  Top 0.305: U$1.16 31.19,95.94 28.14,95.94 24.8,92.6 Y1.1 23.39,92.41 22.95,92.85 C4.1
N$57
  Top 0.305: U$1.17 30.51,95.49 28.33,95.49 25.77,92.92 25.77,92.01 24.8,91.05 Y1.2 23.29,87.59 22.85,87.15 C2.1
N$71
  Top 0.305: U$1.6 42.4,96.4 43.9,96.4 45.4,97.9 45.4,98.4 46,99 C5.2
N$73
  Top 0.305: J3.B7 56.75,92.35 56.6,92.2 55.75,92.2 | J3.A7 55.75,92.2 | R7.2 49.41,93 51.22,91.19 54.73,91.19 55.75,92.2
N$74
  Top 0.305: J3.A6 56.25,94.65 56.1,94.8 55.4,94.8 55.25,94.65 J3.B6 55.25,92.35 54.54,91.64 51.41,91.64 48.55,94.5 R1.2
N$75
  Top 0.305: R4.2 D1.C
N$76
  Top 0.305: R6.2 D3.C
RESET
  Top 0.305: U$1.13 32.78,97.74 27.03,97.74 R2.1
RXI  (via drill 0.35)
  Top 0.305: U$1.20 31.41,91.2 v31.59,91.2
  Bottom 0.305: v31.59,91.2 31.59,90.77 32.29,90.07 32.87,90.07 33.33,89.61 34.99,89.61 35.16,89.44 40.23,89.44 41.23,90.44 42.87,90.44 43.41,89.9 58.21,89.9 58.43,90.12 59.49,90.12 64.46,85.16 91.16,85.16 PAD5.1
SCK
  Top 0.305: U$1.9 39.2,96.59 39.2,97.85 37.93,99.11 23.02,99.11 19.49,95.58 19.49,92.1 J1.3
TOUCH2_K0  (via drill 0.35)
  Top 0.254: v5.57,89.77 5.83,89.77 7.03,88.58 IC1.6
  Bottom 0.254: v5.57,89.77 5.86,89.47 5.86,82.99 4.2,81.33 v4.2,77.1
  pour Top: 0.7,77.5 0.7,0.7 13.59,0.7 13.59,32 8.23,32 8.23,77.5
TOUCH2_K1  (via drill 0.35)
  Top 0.254: IC1.5 6.38,88.62 5.89,89.11 5.29,89.11 4.91,89.49 4.91,90.04 5,90.12 v5,90.58
  Bottom 0.254: v5,90.58 5.35,90.58 5.5,90.42 5.84,90.42 6.27,90 6.27,85 6.27,84.92 6.27,82.96 6.67,82.56 6.67,80.52 9.29,77.9 12.3,77.9 v13.1,77.1
  pour Top: 16.56,33.4 9.63,33.4 9.63,77.5 16.56,77.5
TOUCH2_K2  (via drill 0.35)
  Top 0.254: IC1.2 4.42,89.12 4.24,89.31 4.24,91.11 v4.47,91.34
  Top 0.305: IC1.2 4.42,86.03 4.3,85.91 3.83,85.91 3.65,85.73 3.65,85.56 3.15,85.05 R63.1
  Bottom 0.254: v4.47,91.34 4.58,91.24 5.27,91.24 5.67,90.83 6.01,90.83 6.67,90.16 6.67,83.13 7.07,82.73 7.07,80.69 9.46,78.31 12.47,78.31 12.88,77.9 17.3,77.9 17.7,77.5 21,77.5 v21.4,77.1
  pour Top: 27.87,0.7 14.99,0.7 14.99,32 17.96,32 17.96,77.5 24.9,77.5 24.9,32 27.87,32
TOUCH2_K3  (via drill 0.35)
  Top 0.254: IC1.1 3.77,91.61 v4.46,92.3
  Bottom 0.254: v4.46,92.3 4.46,92.28 5.1,91.64 5.43,91.64 5.84,91.24 6.18,91.24 7.08,90.33 7.08,83.3 7.48,82.9 7.48,80.86 9.63,78.71 12.64,78.71 13.04,78.31 17.47,78.31 17.87,77.91 21.17,77.91 21.18,77.9 25.7,77.9 26.1,77.5 29.3,77.5 v29.7,77.1
  pour Top: 26.3,77.5 26.3,33.4 33.23,33.4 33.23,77.5
TOUCH2_K4  (via drill 0.35)
  Top 0.254: IC1.25 5.72,92.67 5.62,92.57 5.62,92.55 v5.37,92.3
  Bottom 0.254: v5.37,92.3 5.37,92.28 6.01,91.64 6.34,91.64 7.49,90.5 7.49,84.5 7.49,84.42 7.49,83.47 7.89,83.07 7.89,81.03 9.79,79.12 12.8,79.12 13.21,78.71 17.64,78.71 18.04,78.31 25.86,78.31 26.27,77.91 33.49,77.91 33.9,77.5 37.9,77.5 v38.3,77.1
  pour Top: 42.16,0.7 29.27,0.7 29.27,32 34.63,32 34.63,77.5 42.16,77.5
TOUCH2_K5  (via drill 0.35)
  Top 0.254: IC1.24 6.38,92.39 v6.28,92.3
  Top 0.305: R65.1 8.15,96.65 7.7,96.2 6.9,96.2 6.38,95.67 IC1.24
  Bottom 0.254: v6.28,92.3 6.28,92.28 7.89,90.67 7.89,83.64 8.29,83.24 8.29,81.2 9.96,79.53 12.97,79.53 13.38,79.12 17.8,79.12 18.2,78.72 26.03,78.72 26.44,78.31 33.66,78.31 34.07,77.91 38.42,77.91 38.84,77.49 46.31,77.49 v46.7,77.1
  pour Top: 56.44,0.7 43.56,0.7 43.56,77.5 49.9,77.5 49.9,32 56.44,32
TOUCH2_K6  (via drill 0.35)
  Top 0.254: IC1.22 7.67,93 7.19,92.52 v7.19,92.3
  Top 0.305: IC1.22 7.67,94.86 8.2,95.39 9.13,95.39 9.54,95.8 11.99,95.8 12.85,96.65 R64.1
  Bottom 0.254: v7.19,92.3 7.19,91.94 8.3,90.84 8.3,84.1 8.3,84.08 8.3,83.8 8.7,83.4 8.7,81.36 10.13,79.93 13.14,79.93 13.55,79.53 17.97,79.53 18.37,79.13 26.2,79.13 26.61,78.72 33.83,78.72 34.24,78.31 38.59,78.31 39.01,77.9 50.7,77.9 51.1,77.5 54.3,77.5 v54.7,77.1
  pour Top: 58.23,33.4 51.3,33.4 51.3,77.5 58.23,77.5
TOUCH2_K7  (via drill 0.35)
  Top 0.254: IC1.21 8.32,92.83 8.1,92.6 v8.1,92.3
  Bottom 0.254: v8.1,92.3 8.1,91.61 8.71,91.01 8.71,83.97 9.11,83.57 9.11,81.53 10.3,80.34 13.31,80.34 13.72,79.93 18.14,79.93 18.54,79.53 26.37,79.53 26.77,79.13 34,79.13 34.41,78.72 38.76,78.72 39.17,78.31 50.87,78.31 51.27,77.91 59.09,77.91 59.5,77.5 62.7,77.5 v63.1,77.1
  pour Top: 70.73,0.7 57.84,0.7 57.84,32 59.63,32 59.63,77.5 66.56,77.5 66.56,32 70.73,32
TOUCH2_K8  (via drill 0.35)
  Top 0.254: IC1.19 9.62,92.92 v9.01,92.31 v9.01,92.3
  Bottom 0.254: v9.01,92.3 9.01,91.28 9.11,91.17 9.11,84.14 9.51,83.74 9.51,81.7 10.47,80.75 13.48,80.75 13.51,80.71 13.88,80.34 18.31,80.34 18.71,79.94 26.54,79.94 26.94,79.53 34.17,79.53 34.57,79.13 38.93,79.13 39.34,78.71 51.04,78.71 51.44,78.31 59.26,78.31 59.67,77.91 67.39,77.91 67.8,77.5 71,77.5 v71.4,77.1
  pour Top: 67.96,77.5 67.96,33.4 74.9,33.4 74.9,77.5
TOUCH2_K9  (via drill 0.35)
  Top 0.254: IC1.18 10.28,92.78 9.92,92.42 v9.92,92.28
  Bottom 0.254: v79.7,77.1 78.89,77.91 67.97,77.91 67.56,78.31 59.84,78.31 59.43,78.72 51.6,78.72 51.2,79.12 39.51,79.12 39.1,79.53 34.74,79.53 34.34,79.94 27.11,79.94 26.7,80.34 18.88,80.34 18.48,80.75 14.05,80.75 13.95,80.85 13.65,81.15 10.64,81.15 9.92,81.87 9.92,83.91 9.52,84.31 9.52,91.88 v9.92,92.28
  pour Top: 85.01,0.7 72.13,0.7 72.13,32 76.3,32 76.3,77.5 83.23,77.5 83.23,32 85.01,32
TOUCH2_K10  (via drill 0.35)
  Top 0.254: IC1.16 11.57,93.05 v10.83,92.3
  Bottom 0.254: v10.83,92.3 10.83,92.23 9.92,91.32 9.92,84.48 10.32,84.08 10.32,82.04 10.8,81.56 13.81,81.56 14.04,81.34 14.22,81.15 18.65,81.15 19.05,80.75 26.87,80.75 27.28,80.34 34.5,80.34 34.91,79.94 39.27,79.94 39.68,79.53 51.37,79.53 51.77,79.13 59.6,79.13 60.01,78.72 67.73,78.72 68.14,78.31 81.89,78.31 82.3,77.9 87.2,77.9 v88,77.1
  pour Top: 91.56,33.4 84.63,33.4 84.63,77.5 91.56,77.5
TOUCH2_K11  (via drill 0.35)
  Top 0.254: IC1.15 12.22,92.77 v11.73,92.28
  Bottom 0.254: v11.73,92.28 10.33,90.87 10.33,84.65 10.73,84.25 10.73,82.4 10.73,82.21 10.97,81.96 13.98,81.96 14.39,81.56 18.82,81.56 19.21,81.16 27.04,81.16 27.45,80.75 34.67,80.75 35.08,80.34 39.43,80.34 39.85,79.93 51.54,79.93 51.94,79.53 59.77,79.53 60.17,79.13 67.9,79.13 68.31,78.72 82.06,78.72 82.47,78.31 91.89,78.31 92.7,77.5 95.8,77.5 v96.2,77.1
  pour Top: 99.3,0.7 86.41,0.7 86.41,32 92.96,32 92.96,77.5 99.3,77.5
TOUCH2_SENADJ0
  Top 0.305: C46.2 4.5,85.4 5,85.9 5.2,85.9 5.72,86.42 IC1.4
TOUCH2_SENADJ1
  Top 0.305: C74.2 11.03,96.46 9.56,96.46 8.95,95.84 7.99,95.84 7.89,95.74 7.3,95.74 7.03,95.47 IC1.23
TOUCH2_SENADJ2
  Top 0.305: IC1.17 10.93,95.06 11.2,95.34 12.19,95.34 12.65,95.8 15.2,95.8 16.02,96.62 C75.2
TOUCH2_SENADJ3
  Top 0.305: C19.2 7.3,85.1 7.8,85.1 8.97,86.28 IC1.9
TOUCH2_SLPSENA
  Top 0.305: IC1.28 3.77,94.83 3.3,95.3 3.3,95.8 2.48,96.62 C73.2
TOUCH2_SLPSENB
  Top 0.305: C48.2 13.03,85.08 12.22,85.88 IC1.14
TXLED  (via drill 0.35)
  Top 0.305: U$1.22 30,90.34 v30,90 | R6.1 62.65,92.3 62.09,92.3 59.73,89.93 59.73,88.54 v59.13,87.94
  Bottom 0.305: v30,90 31.07,90 31.91,89.16 32.49,89.16 32.95,88.7 34.5,88.7 34.66,88.53 58.34,88.53 58.93,87.94 v59.13,87.94
TXO  (via drill 0.35)
  Top 0.305: U$1.21 30.77,90.7 v30.8,90.7
  Bottom 0.305: v30.8,90.7 31.04,90.46 31.25,90.46 32.1,89.61 32.68,89.61 33.14,89.16 34.7,89.16 34.87,88.99 40.42,88.99 41.42,89.98 42.68,89.98 43.22,89.44 58.44,89.44 58.66,89.67 59.3,89.67 64.27,84.7 86.5,84.7 86.73,84.7 90.34,84.7 90.93,84.12 93.12,84.12 PAD6.1
UVCC
  Top 0.305: F1.1 48.9,89.2 47.5,90.6 44.7,90.6 44.1,90 42.2,90 41.7,90.5 41.7,91.17 | 41.7,91.17 U$1.2 | U$1.7 38.7,93.83 38.7,93.1 40.62,91.17 41.7,91.17 | C6.2 49.2,97.5 50.5,96.2 53.3,96.2 54.21,95.29
  Top 0.45: J3.VBUS2 53.55,94.25 53.91,94.61 53.91,95 54.21,95.29 54.21,95.3 54.7,95.3 54.9,95.5 56.6,95.5 57.2,94.9 57.8,94.9 58.09,94.61 58.45,94.25 J3.VBUS1
  Top 0.61: J3.VBUS1 58.45,92.54 57.04,91.13 56.19,91.13 55.17,90.12 51.22,90.12 50.3,89.2 F1.1
VCC  (via drill 0.35)
  Top 0.254: R5.1 11.55,83.35 v11.6,83.3
  Top 0.305: IC1.26 v5.08,95.5 | R10.2 R9.2 R13.2 R11.2 R12.2 R8.2 | R10.2 55.3,88.9 54.69,89.51 51.47,89.51 49.76,87.8 48.4,87.8 48.1,88.1 48.1,88.7 47.6,89.2 F1.2 | R2.2 24.75,96.94 25.55,96.14 26.91,96.14 27.09,96.31 27.09,96.97 27.4,97.29 32.11,97.29 U$1.14 | v17.6,85.1 17.55,85.05 C3.2 | v28.6,87.2 28.6,85.14 LDR1.P$2 | R10.2 55.35,89.43 56.44,90.52 57.29,90.52 58.87,92.1 60.6,92.1 61.12,92.62 61.12,98.28 61.6,98.75 D1.A D3.A LED1.A
  Top 0.406: v5.08,95.5 5.08,96.5 C76.2
  Top 0.48: U$1.34 36.4,83.94 v36.4,85.1 | U$1.24 29.44,87.96 28.68,87.2 v28.6,87.2 | U$1.14 35.1,94.29 35.1,93.62 | U$1.44 43.5,89.3 46.4,89.3 F1.2
  Top 0.508: v3,92.3 2.8,92.1 C77.2 | 35.1,93.62 35.1,93.61 31.91,90.42 31.59,90.42 31.59,90.38 31.12,89.92 31.02,89.92 30.2,89.09 30.2,88.72 29.44,87.96
  Top 0.61: C13.A F1.2 | C10.1 47,84 46.5,84.5 C13.A | v45.1,85.1 45.7,85.7 C13.A | v59.32,82.68 59.32,82.79 59.95,83.42 59.95,84.34 60.19,84.58 61.32,84.58 61.82,85.08 69.55,85.08 70.6,84.03 v70.6,83.93 | PAD7.1 75.7,91.5 75.04,90.84 75.04,87.06 v78.09,84.02
  Bottom 0.254: v11.6,83.3 11.14,83.76 11.14,84.41 10.74,84.81 10.74,90.71 11.65,91.62 12.01,91.62 12.69,92.3 12.84,92.3
  Bottom 0.305: 17.53,86.5 17.6,86.43 v17.6,85.1
  Bottom 0.508: v12.84,92.26 12.84,92.3 12.84,92.66 12.4,93.1 5.3,93.1 5.08,93.33 | 5.08,93.33 v5.08,95.5 | 5.08,93.33 4.03,93.33 v3,92.3
  Bottom 0.61: v12.84,92.26 13.5,91.6 13.5,89.6 15.1,88 J1.2 16.63,86.5 17.53,86.5 24.31,86.5 24.34,86.47 27.87,86.47 v28.6,87.2 31.2,87.2 34.06,84.34 35.17,84.34 35.94,85.1 v36.4,85.1 v45.1,85.1 49.32,85.1 49.35,85.14 55.37,85.14 56.35,84.15 56.35,83.67 57,83.03 57,82.72 57.95,81.77 58.65,81.77 59.13,82.25 59.13,82.5 v59.32,82.68 | v70.6,83.93 70.76,84.09 78.02,84.09 v78.09,84.02

### Text on the board
Bottom: Peter van der Walt - 2021
bPlace: GND | SDO | SCL | VCC | D13 | D12 | D11 | D7 | RX | TX
bStop: Peter van der Walt - 2021